# EAGLE design FC_nano (EAGLE 9.6.2)
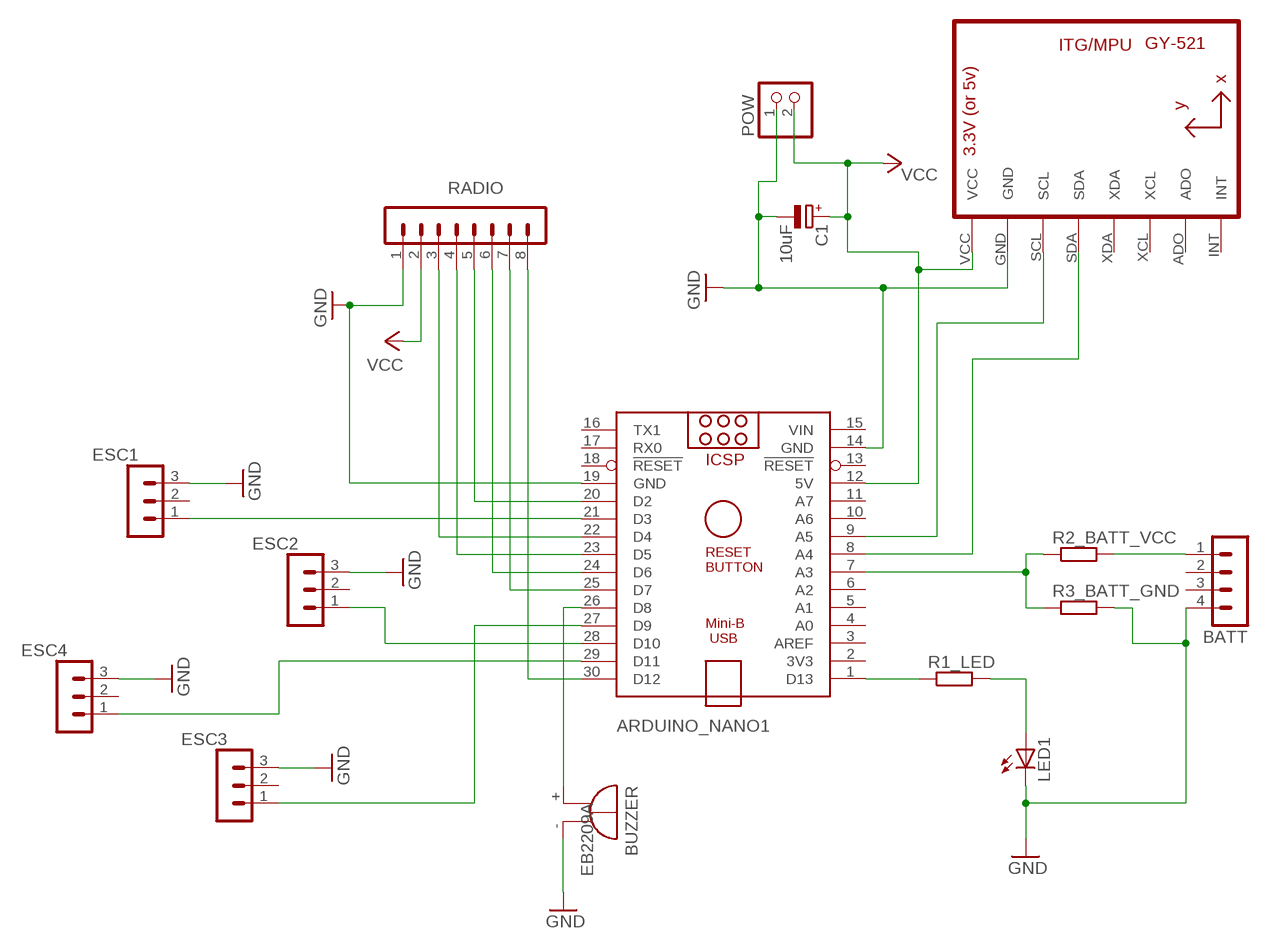
[diagram p0: schematic, sheet 1]

## Parts
ARDUINO_NANO1  ARDUINO_NANO  [ARDUINO_NANO]
BATT  MA04-1  [MA04-1]
BUZZER  EB2209A  [EB2209A]
C1  10uF  CPOL-EUE2-5  [E2-5]
ESC1  MA03-1  [MA03-1]
ESC2  MA03-1  [MA03-1]
ESC3  MA03-1  [MA03-1]
ESC4  MA03-1  [MA03-1]
LED1  LED3MM  [LED3MM]
POW  PINHD-1X2  [1X02]
R1_LED  R-EU_0204/7  [0204/7]
R2_BATT_VCC  R-EU_0204/7  [0204/7]
R3_BATT_GND  R-EU_0204/7  [0204/7]
RADIO  MA08-1  [MA08-1]
U1  GY-521MPU6050  [GY-521]

## Nets
GND: ARDUINO_NANO1.14(GND) ARDUINO_NANO1.19(GND) BATT.4 BUZZER.- C1.- ESC1.3 ESC2.3 ESC3.3 ESC4.3 LED1.K(C) POW.1 R3_BATT_GND.2 RADIO.1 U1.GND
N$1: ARDUINO_NANO1.21(D3) ESC1.1
N$2: ARDUINO_NANO1.28(D10) ESC2.1
N$3: ARDUINO_NANO1.27(D9) ESC3.1
N$4: ARDUINO_NANO1.29(D11) ESC4.1
N$5: ARDUINO_NANO1.1(D13) R1_LED.1
N$6: ARDUINO_NANO1.20(D2) RADIO.5
N$7: ARDUINO_NANO1.22(D4) RADIO.3
N$8: ARDUINO_NANO1.23(D5) RADIO.4
N$9: ARDUINO_NANO1.24(D6) RADIO.6
N$10: ARDUINO_NANO1.8(A4) U1.SDA
N$11: ARDUINO_NANO1.9(A5) U1.SCL
N$12: ARDUINO_NANO1.25(D7) RADIO.7
N$13: LED1.A R1_LED.2
N$14: ARDUINO_NANO1.30(D12) RADIO.8
N$15: ARDUINO_NANO1.26(D8) BUZZER.+
N$16: BATT.1 R2_BATT_VCC.2
N$17: ARDUINO_NANO1.7(A3) R2_BATT_VCC.1 R3_BATT_GND.1
VCC: ARDUINO_NANO1.12(5V) C1.+ POW.2 RADIO.2 U1.VCC
Unconnected: ARDUINO_NANO1.2(3V3) ARDUINO_NANO1.3(AREF) ARDUINO_NANO1.4(A0) ARDUINO_NANO1.5(A1) ARDUINO_NANO1.6(A2) ARDUINO_NANO1.10(A6) ARDUINO_NANO1.11(A7) ARDUINO_NANO1.13(!RESET) ARDUINO_NANO1.16(TX1) ARDUINO_NANO1.17(RX0) ARDUINO_NANO1.18(!RESET) BATT.2 BATT.3 ESC1.2 ESC2.2 ESC3.2 ESC4.2 U1.ADO U1.INT U1.XCL U1.XDA

## Power pins joined to a net without a drawn wire
VIN: ARDUINO_NANO1.15(VIN)

## Library data of the parts
ARDUINO_NANO1 = ArduinoNanoV30:ARDUINO_NANO: Arduino Nano V3.0 Overview: The Arduino Nano is a small, complete, and breadboard-friendly board based on the ATmega328 (Arduino Nano 3.x) or ATmega168 (Arduino Nano 2.x). It has more or less the same functionality of the Arduino Duemilanove, but in a different package. It lacks only a DC power jack, and works with a Mini-B USB cable instead of a standard one. The Nano was designed and is being produced by Gravitech. Specifications: Microcontroller Atmel ATmega168 or ATmega328 Operating Voltage (logic level) 5 V Input Voltage (recommended) 7-12 V Input Voltage (limits) 6-20 V Digital I/O Pins 14 (of which 6 provide PWM output) Analog Input Pins 8 DC Current per I/O Pin 40 mA Flash Memory 16 KB (ATmega168) or 32 KB (ATmega328) of which 2 KB used by bootloader SRAM 1 KB (ATmega168) or 2 KB (ATmega328) EEPROM 512 bytes (ATmega168) or 1 KB (ATmega328) Clock Speed 16 MHz Dimensions 0.73" x 1.70" Length 45 mm Width 18 mm Weigth 5 g Power: The Arduino Nano can be powered via the Mini-B USB connection, 6-20V unregulated external power supply (pin 30), or 5V regulated external power supply (pin 27). The power source is automatically selected to the highest voltage source. Memory: The ATmega168 has 16 KB of flash memory for storing code (of which 2 KB is used for the bootloader); the ATmega328 has 32 KB, (also with 2 KB used for the bootloader). The ATmega168 has 1 KB of SRAM and 512 bytes of EEPROM (which can be read and written with the EEPROM library); the ATmega328 has 2 KB of SRAM and 1 KB of EEPROM. Input and Output: Each of the 14 digital pins on the Nano can be used as an input or output, using pinMode(), digitalWrite(), and digitalRead() functions. They operate at 5 volts. Each pin can provide or receive a maximum of 40 mA and has an internal pull-up resistor (disconnected by default) of 20-50 kOhms. In addition, some pins have specialized functions. Visit Arduino - ArduinoBoardNano <https://www.arduino.cc/en/Main/ArduinoBoardNano>
BATT = con-lstb:MA04-1: PIN HEADER; OC_FARNELL: unknown; OC_NEWARK: unknown
BUZZER = buzzer:EB2209A: BUZZER Source: Buerklin; OC_FARNELL: unknown; OC_NEWARK: unknown
C1 = rcl:CPOL-EU: POLARIZED CAPACITOR, European symbol; SPICEPREFIX: C
ESC1-ESC4 = con-lstb:MA03-1: PIN HEADER; OC_FARNELL: unknown; OC_NEWARK: unknown
LED1 = adafruit:LED: LED OSRAM: - CHIPLED LG R971, LG N971, LY N971, LG Q971, LY Q971, LO R971, LY R971 LH N974, LH R974 LS Q976, LO Q976, LY Q976 LO Q996 - Hyper CHIPLED LW Q18S LB Q993, LB Q99A, LB R99A - SideLED LS A670, LO A670, LY A670, LG A670, LP A670 LB A673, LV A673, LT A673, LW A673 LH A674 LY A675 LS A676, LA A676, LO A676, LY A676, LW A676 LS A679, LY A679, LG A679 - Hyper Micro SIDELED® LS Y876, LA Y876, LO Y876, LY Y876 LT Y87S - SmartLED LW L88C, LW L88S LB L89C, LB L89S, LG L890 LS L89K, LO L89K, LY L89K LS L896, LA L896, LO L896, LY L896 - TOPLED LS T670, LO T670, LY T670, LG T670, LP T670 LSG T670, LSP T670, LSY T670, LOP T670, LYG T670 LG T671, LOG T671, LSG T671 LB T673, LV T673, LT T673, LW T673 LH T674 LS T676, LA T676, LO T676, LY T676, LB T676, LH T676, LSB T676, LW T676 LB T67C, LV T67C, LT T67C, LS T67K, LO T67K, LY T67K, LW E67C LS E67B, LA E67B, LO E67B, LY E67B, LB E67C, LV E67C, LT E67C LW T67C LS T679, LY T679, LG T679 LS T770, LO T770, LY T770, LG T770, LP T770 LB T773, LV T773, LT T773, LW T773 LH T774 LS E675, LA E675, LY E675, LS T675 LS T776, LA T776, LO T776, LY T776, LB T776 LHGB T686 LT T68C, LB T68C - Hyper Mini TOPLED® LB M676 - Mini TOPLED Santana® LG M470 LS M47K, LO M47K, LY M47K Source: http://www.osram.convergy.de/
POW = pinhead:PINHD-1X2: PIN HEADER
R1_LED R2_BATT_VCC R3_BATT_GND = rcl:R-EU_: RESISTOR, European symbol; SPICEPREFIX: R
RADIO = con-lstb:MA08-1: PIN HEADER; OC_FARNELL: unknown; OC_NEWARK: unknown
U1 = gy-521:GY-521

## Net classes
0 default: width 0.25 mm

## Board
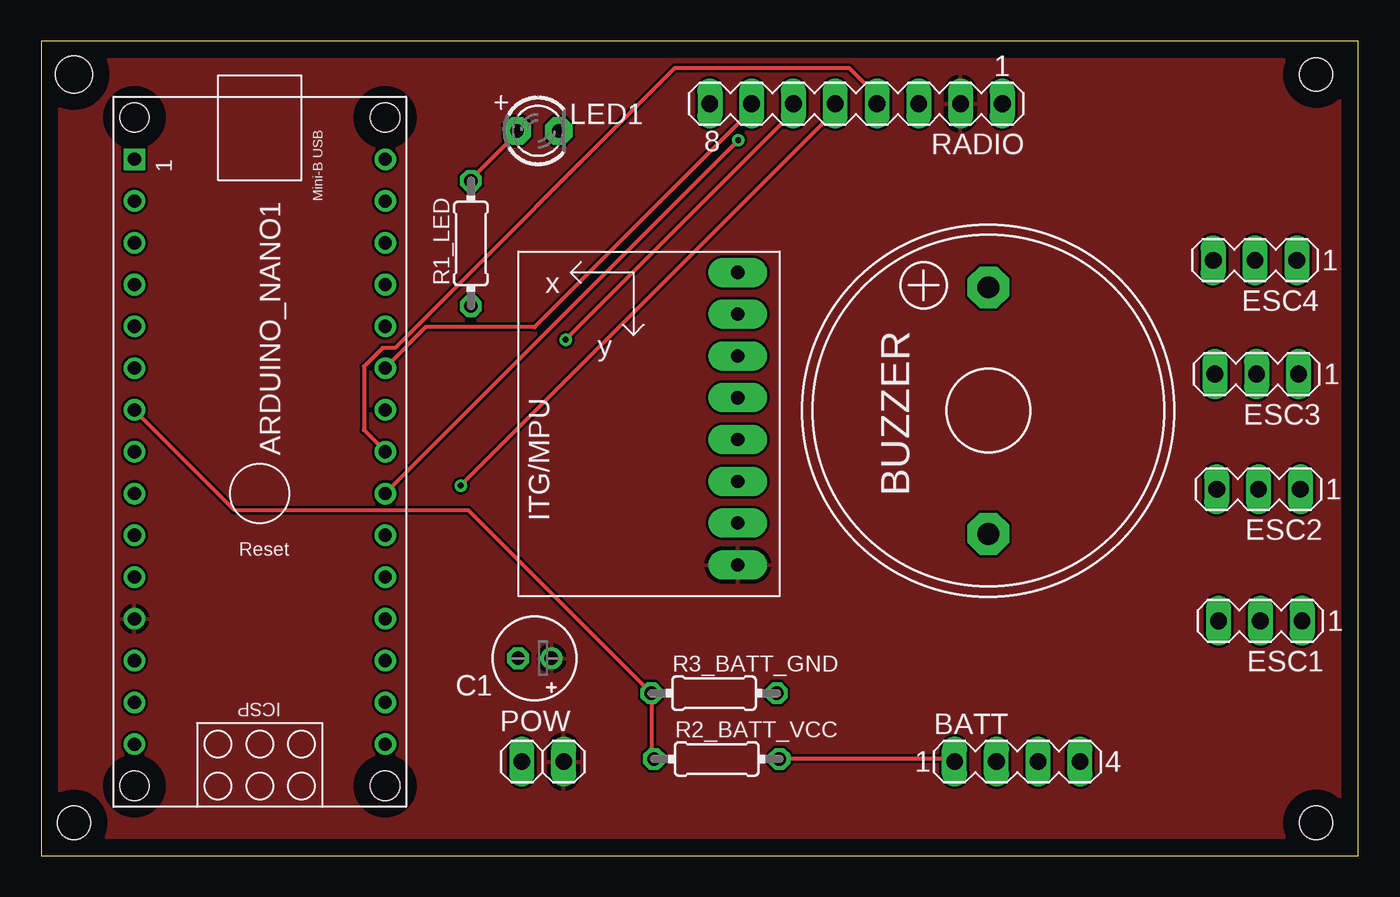
[diagram p1: board, top side]
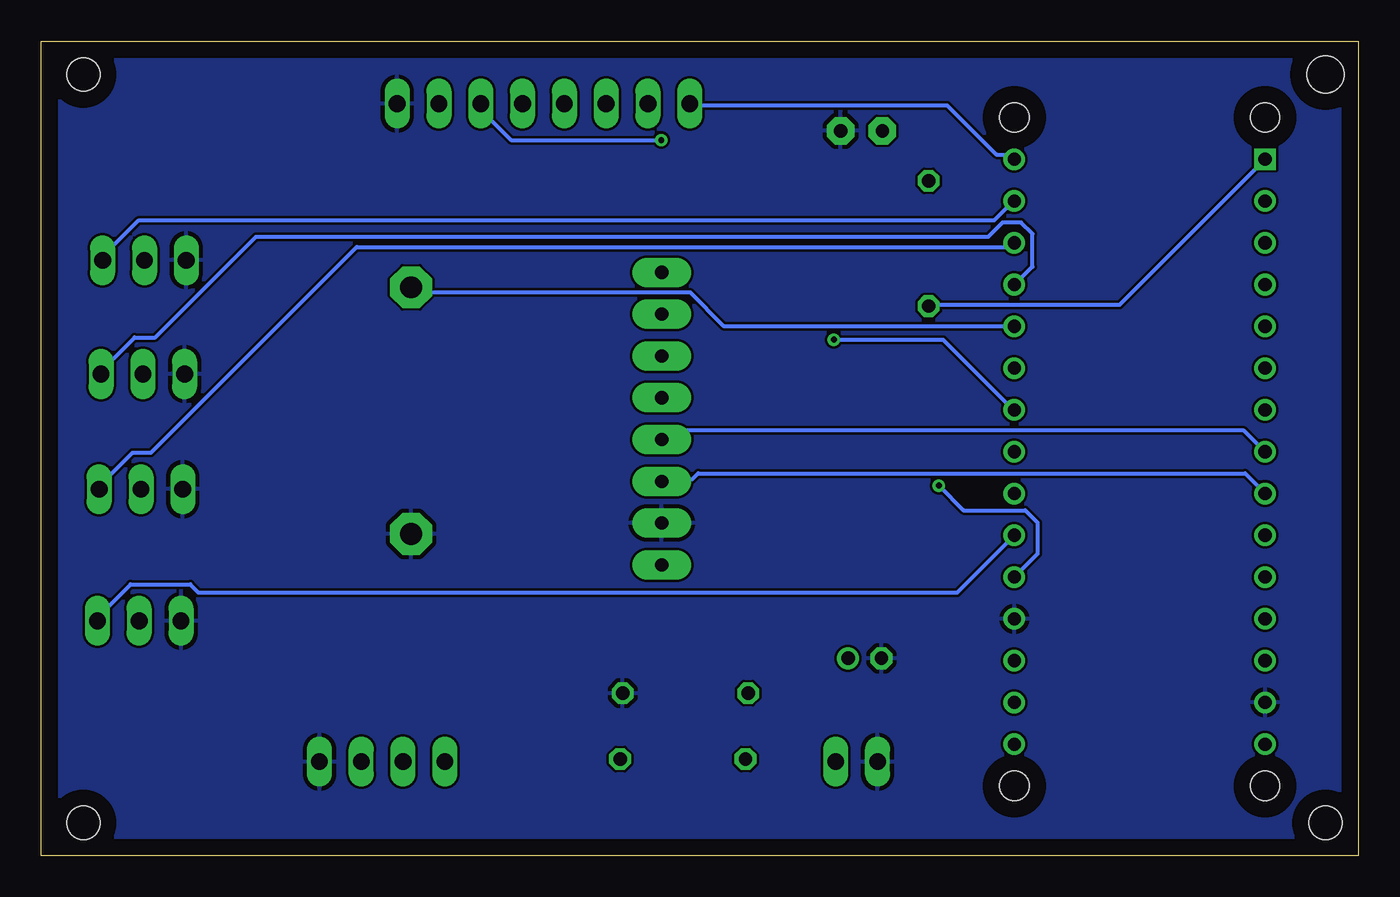
[diagram p2: board, bottom side, seen from below]

Size 80.06 x 49.52 mm. Coordinates in mm from the lower left corner, seen from the top.
Outline: 0,0 80.06,0 80.06,49.52 0,49.52 0,0
Copper layers (1*16): Top 0.035mm / dielectric 1.5mm / Bottom 0.035mm
Design rules "default": minimum track width 6mil, minimum drill 0.35mm, track to track 6mil, track to pad 6mil, pad to pad 6mil, via to via 6mil, smd to smd 6mil, copper to edge 40mil, drill to drill 6mil, minimum pad ring 10mil, minimum via ring 8mil, stop-mask expansion 4mil, vias tented up to drill 0mil, thermal gap 10mil
Holes 2.25 mm at 2,47.5
Holes 2 mm at 2,2 77.5,47.5 77.5,2

### Footprints (pad centres in the part's own frame; a part is rotated, then mirrored left to right if it is on the bottom)
ARDUINO_NANO = drill 0.8 square: 1 -20.32,-7.62 | drill 0.8: 2 -17.78,-7.62; 3 -15.24,-7.62; 4 -12.7,-7.62; 5 -10.16,-7.62; 6 -7.62,-7.62; 7 -5.08,-7.62; 8 -2.54,-7.62; 9 0,-7.62; 10 2.54,-7.62; 11 5.08,-7.62; 12 7.62,-7.62; 13 10.16,-7.62; 14 12.7,-7.62; 15 15.24,-7.62; 16 15.24,7.62; 17 12.7,7.62; 18 10.16,7.62; 19 7.62,7.62; 20 5.08,7.62; 21 2.54,7.62; 22 0,7.62; 23 -2.54,7.62; 24 -5.08,7.62; 25 -7.62,7.62; 26 -10.16,7.62; 27 -12.7,7.62; 28 -15.24,7.62; 29 -17.78,7.62; 30 -20.32,7.62 | hole 1.778: -22.86,-7.62; -22.86,7.62; 17.78,7.62; 17.78,-7.62
MA04-1 = drill 1.016 long: 1 -3.81,0; 2 -1.27,0; 3 1.27,0; 4 3.81,0
EB2209A = drill 1.321 pad 2.54 octagon: + 7.493,0; - -7.493,0
E2-5 = drill 0.813 pad 1.27: + -1.016,0 | drill 0.813 pad 1.27 octagon: - 1.016,0
MA03-1 = drill 1.016 long: 1 -2.54,0; 2 0,0; 3 2.54,0
LED3MM = drill 0.813 pad 1.676 octagon: A -1.27,0; K 1.27,0
1X02 = drill 1.016 long: 1 -1.27,0; 2 1.27,0
0204/7 = drill 0.813 octagon: 1 -3.81,0; 2 3.81,0
MA08-1 = drill 1.016 long: 1 -8.89,0; 2 -6.35,0; 3 -3.81,0; 4 -1.27,0; 5 1.27,0; 6 3.81,0; 7 6.35,0; 8 8.89,0
GY-521 = drill 0.8 pad 1.778 long: ADO -8.89,-6.35; GND -8.89,6.35; INT -8.89,-8.89; SCL -8.89,3.81; SDA -8.89,1.27; VCC -8.89,8.89; XCL -8.89,-3.81; XDA -8.89,-1.27

### Placement (x,y rotation side)
ARDUINO_NANO1  13.29,22.02 270 top
BATT  59.33,5.72 0 top
BUZZER  57.57,27.06 90 top
C1  30,12 180 top
ESC1  74.1,14.28 180 top
ESC2  73.99,22.28 180 top
ESC3  73.88,29.28 180 top
ESC4  73.78,36.2 180 top
LED1  30.2,44.07 0 top
POW  30.49,5.72 0 top
R1_LED  26.12,37.22 90 top
R2_BATT_VCC  41.06,5.88 0 top
R3_BATT_GND  40.9,9.88 0 top
RADIO  49.53,45.72 180 top
U1  33.45,26.57 180 top

### Tracks (layer width: path | path; a pad name or v marks a point on that pad's centre or on a via)
GND
  pour Bottom: -4,50 -4,-4 -1,-7 84,-7 86,-5 86,49 82,53 -1,53
N$1
  Bottom 0.25: ARDUINO_NANO1.21 21,19.38 24.38,16 70.5,16 71,16.5 74.62,16.5 76.75,14.38 ESC1.1
N$2
  Bottom 0.25: ARDUINO_NANO1.28 21,37.25 21.25,37 60.88,37 73.38,24.5 74.5,24.5 76.62,22.38 ESC2.1
N$3
  Bottom 0.25: ARDUINO_NANO1.27 20.88,34.75 19.81,35.81 19.81,37.81 20.5,38.5 21.62,38.5 22.5,37.62 67,37.62 73.12,31.5 74.38,31.5 76.5,29.38 ESC3.1
N$4
  Bottom 0.25: ARDUINO_NANO1.29 21,39.75 22.12,38.62 74.12,38.62 76.25,36.5 76.25,36.25 ESC4.1
N$5
  Bottom 0.25: ARDUINO_NANO1.1 5.75,42.25 14.5,33.5 26,33.5 R1_LED.1
N$6  (via drill 0.35)
  Top 0.25: v25.5,22.5 48.25,45.25 48.25,45.62 RADIO.5
  Bottom 0.25: v25.5,22.5 24,21 20.25,21 19.5,20.25 19.5,18.35 ARDUINO_NANO1.20
N$7  (via drill 0.35)
  Top 0.25: v42.38,43.5 21,22.12 ARDUINO_NANO1.22
  Bottom 0.25: v42.38,43.5 51.5,43.5 53.25,45.25 53.25,45.62 RADIO.3
N$8
  Top 0.25: ARDUINO_NANO1.23 20.88,24.62 19.62,25.88 19.62,29.75 20.75,30.88 21.5,30.88 38.5,47.88 49.12,47.88 49.88,47.12 50,47 50.75,46.25 50.75,45.75 RADIO.4
N$9  (via drill 0.35)
  Top 0.25: v31.88,31.38 45.62,45.12 45.62,45.62 RADIO.6
  Bottom 0.25: v31.88,31.38 25.25,31.38 21,27.12 ARDUINO_NANO1.24
N$10
  Bottom 0.25: ARDUINO_NANO1.8 5.75,24.62 7,25.88 40.75,25.88 41.25,25.38 42.25,25.38 U1.SDA
N$11
  Bottom 0.25: ARDUINO_NANO1.9 5.75,22.12 6.88,23.25 40.12,23.25 40.5,22.88 42.25,22.88 U1.SCL
N$12
  Top 0.25: ARDUINO_NANO1.25 21,29.75 23.38,32.12 30,32.12 43.12,45.25 43.12,45.62 RADIO.7
N$13
  Top 0.25: R1_LED.2 26.12,41.12 28.88,43.88 28.88,44 LED1.A
N$14
  Bottom 0.25: ARDUINO_NANO1.30 21,42.38 21.25,42.62 22,42.62 25,45.62 40.62,45.62 RADIO.8
N$15
  Bottom 0.25: BUZZER.+ 57.27,34.25 40.62,34.25 38.55,32.18 ARDUINO_NANO1.26
N$16
  Top 0.25: R2_BATT_VCC.2 55.5,5.88 55.5,5.75 BATT.1
N$17
  Top 0.25: ARDUINO_NANO1.7 11.77,21 25.97,21 R3_BATT_GND.1 37.09,6.04 R2_BATT_VCC.1
VCC
  pour Top: -3,51 -3,-4 0,-7 82,-7 85,-4 85,49 81,53 -1,53

### Text on the board
tTest: D12 | D7 | D6 | D2 | D5 | D4 | 5V | GND | Il garage del Bicchio | GND | SGN | GND | SGN | SDA | GND | SGN | SCL | GND | 5V | GND | SGN | Arduino Nano / MultiWii FC | GND | 5V | GND
bTest: JLCJLCJLCJLC